# EAGLE design Tachometer-with-4x7-Segm-LED-Display_pcb (EAGLE 9.6.2)
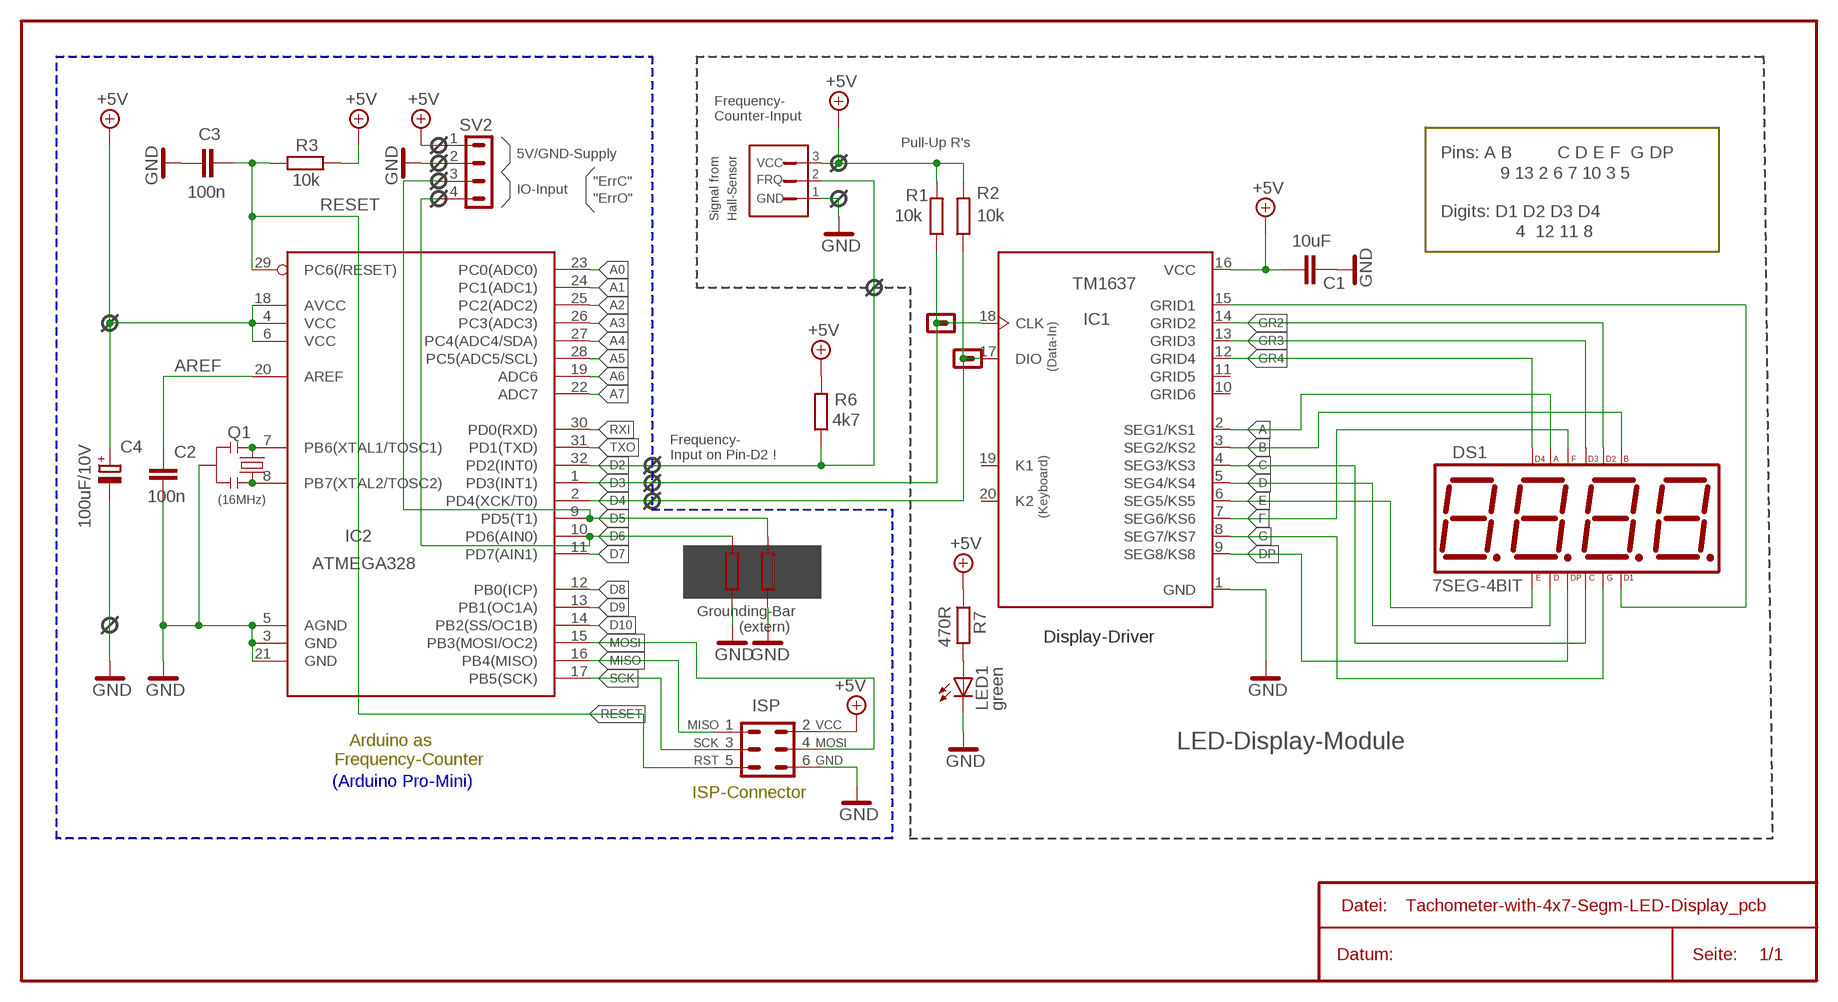
[diagram p0: schematic, sheet 1]

## Parts
C1  10uF  C-EUC0805  [C0805]
C2  100n  C-EUC0603  [C0603]
C3  100n  C-EUC0603  [C0603]
C4  100uF/10V  CPOL-EUE2.5-7  [E2,5-7]
DS1  7SEG-4BIT  7SEG-4BT  [7SEG-14-4BIT]
H  Hall-Ss.  3JST-XH  [3JST-XH]
IC1  TM1637  [SOP-20]
IC2  ATMEGA328  ATMEGA168  [TQFP32-08]
ISP  MA03-2  [MA03-2]
LED1  green  LEDCHIPLED_0603  [CHIPLED_0603]
Q1  (16MHz)  RESONATOR1:1  [RESONATOR-SMD-1:1]
R1  10k  R-EU_R0603  [R0603]
R2  10k  R-EU_R0603  [R0603]
R3  10k  R-EU_R0603  [R0603]
R4  10k  R-EU_R0603  [R0603]
R5  10k  R-EU_R0603  [R0603]
R6  4k7  R-EU_R0603  [R0603]
R7  470R  R-EU_R0603  [R0603]
SV2  MA04-10  [MA04-1]

## Nets
+5V: C1.1 C4.+ H.1 IC1.16(VCC) IC2.4(VCC) IC2.6(VCC) IC2.18(AVCC) ISP.2 R1.2 R2.2 R3.2 R6.2 R7.1 SV2.1
A: DS1.A IC1.2(SEG1/KS1)
A0: IC2.23(PC0(ADC0))
A1: IC2.24(PC1(ADC1))
A2: IC2.25(PC2(ADC2))
A3: IC2.26(PC3(ADC3))
A4: IC2.27(PC4(ADC4/SDA))
A5: IC2.28(PC5(ADC5/SCL))
A6: IC2.19(ADC6)
A7: IC2.22(ADC7)
AREF: C2.1 IC2.20(AREF)
B: DS1.B IC1.3(SEG2/KS2)
C: DS1.C IC1.4(SEG3/KS3)
D: DS1.D IC1.5(SEG4/KS4)
D2: H.2 IC2.32(PD2(INT0)) R6.1
D3: IC1.18(CLK) IC2.1(PD3(INT1)) R1.1
D4: IC1.17(DIO) IC2.2(PD4(XCK/T0)) R2.1
D5: IC2.9(PD5(T1)) R5.2 SV2.3
D6: IC2.10(PD6(AIN0)) R4.2 SV2.4
D7: IC2.11(PD7(AIN1))
D8: IC2.12(PB0(ICP))
D9: IC2.13(PB1(OC1A))
D10: IC2.14(PB2(SS/OC1B))
DP: DS1.DP IC1.9(SEG8/KS8)
E: DS1.E IC1.6(SEG5/KS5)
F: DS1.F IC1.7(SEG6/KS6)
G: DS1.G IC1.8(SEG7/KS7)
GND: C1.2 C2.2 C3.1 C4.- H.3 IC1.1(GND) IC2.3(GND) IC2.5(AGND) IC2.21(GND) ISP.6 LED1.C Q1.2 R4.1 R5.1 SV2.2
GR1: DS1.D1 IC1.15(GRID1)
GR2: DS1.D2 IC1.14(GRID2)
GR3: DS1.D3 IC1.13(GRID3)
GR4: DS1.D4 IC1.12(GRID4)
MISO: IC2.16(PB4(MISO)) ISP.1
MOSI: IC2.15(PB3(MOSI/OC2)) ISP.4
N$1: LED1.A R7.2
N$6: IC2.8(PB7(XTAL2/TOSC2)) Q1.3
N$7: IC2.7(PB6(XTAL1/TOSC1)) Q1.1
RESET: C3.2 IC2.29(PC6(/RESET)) ISP.5 R3.1
RXI: IC2.30(PD0(RXD))
SCK: IC2.17(PB5(SCK)) ISP.3
TXO: IC2.31(PD1(TXD))
Unconnected: IC1.10(GRID6) IC1.11(GRID5) IC1.19(K1) IC1.20(K2)

## Notes on the sheet
- Frequency-
  Counter-Input
- Pull-Up R's
- 5V/GND-Supply | 3 | Pins: A B | C D E F  G DP
- VCC
- 2 | 9 13 2 6 7 10 3 5
- FRQ
- IO-Input | 1
- "ErrC"
  "ErrO"
- GND
- Digits: D1 D2 D3 D4
- Signal from
  Hall-Sensor
- 4  12 11 8
- (Data-In)
- Frequency-
  Input on Pin-D2 !
- (Keyboard)
- Grounding-Bar
- (extern)
- Display-Driver
- LED-Display-Module
- Arduino as
  Frequency-Counter
- MISO
  SCK
  RST
- VCC
  MOSI
  GND
- (Arduino Pro-Mini)
- ISP-Connector

## Library data of the parts
C1-C3 = rcl1:C-EU: CAPACITOR, European symbol
C4 = rcl1:CPOL-EU: POLARIZED CAPACITOR, European symbol
DS1 = special:7SEG-4BT: 7-segment LED-Display - 4 bit LED-height: 14 mm Dimensions: 20 x 50 x 6 mm
H = con-jst:3JST-XH: JST-XH Connector: 2.5 mm pitch, disconnectable crimp-style connector • Current rating: 3 A AC/DC (AWG #22) • Voltage rating: 250 V AC/DC • Temperature range: -25°C to +85 • Contact resistance: 10-20 mΩ • Applicable wire: AWG #30 to #22 • Applicable PC board thickness: 1.6 mm • mounting height: 7mm (total height: 9.8mm)
IC1 = special:TM1637: LED Drive Control Special Circuit • Applied power CMOS technique • The display mode (8 segments*6 bit) supports output by common anode LED • Keyboard scan (8×2bit), with enhanced identification circuit with anti-interference keys • Luminance adjustment circuit (adjustable 8 duty ratio) • Two-wire serial interface (CLK, DIO) • Oscillating type: Built-in RC oscillator • Built-in power-on reset circuit • Built-in automatic blanking circuit • Package type: DIP20/SOP20
IC2 = SparkFun:ATMEGA168
ISP = con-lstc:MA03-2: PIN HEADER; OC_FARNELL: unknown; OC_NEWARK: unknown
LED1 = arduino_Uno_Rev3-02-TH:LED: LED OSRAM: - CHIPLED LG R971, LG N971, LY N971, LG Q971, LY Q971, LO R971, LY R971 LH N974, LH R974 LS Q976, LO Q976, LY Q976 LO Q996 - Hyper CHIPLED LW Q18S LB Q993, LB Q99A, LB R99A - SideLED LS A670, LO A670, LY A670, LG A670, LP A670 LB A673, LV A673, LT A673, LW A673 LH A674 LY A675 LS A676, LA A676, LO A676, LY A676, LW A676 LS A679, LY A679, LG A679 - Hyper Micro SIDELED® LS Y876, LA Y876, LO Y876, LY Y876 LT Y87S - SmartLED LW L88C, LW L88S LB L89C, LB L89S, LG L890 LS L89K, LO L89K, LY L89K LS L896, LA L896, LO L896, LY L896 - TOPLED LS T670, LO T670, LY T670, LG T670, LP T670 LSG T670, LSP T670, LSY T670, LOP T670, LYG T670 LG T671, LOG T671, LSG T671 LB T673, LV T673, LT T673, LW T673 LH T674 LS T676, LA T676, LO T676, LY T676, LB T676, LH T676, LSB T676, LW T676 LB T67C, LV T67C, LT T67C, LS T67K, LO T67K, LY T67K, LW E67C LS E67B, LA E67B, LO E67B, LY E67B, LB E67C, LV E67C, LT E67C LW T67C LS T679, LY T679, LG T679 LS T770, LO T770, LY T770, LG T770, LP T770 LB T773, LV T773, LT T773, LW T773 LH T774 LS E675, LA E675, LY E675, LS T675 LS T776, LA T776, LO T776, LY T776, LB T776 LHGB T686 LT T68C, LB T68C - Hyper Mini TOPLED® LB M676 - Mini TOPLED Santana® LG M470 LS M47K, LO M47K, LY M47K Source: http://www.osram.convergy.de LUXEON: - LUMILED® LXK2-PW12-R00, LXK2-PW12-S00, LXK2-PW14-U00, LXK2-PW14-V00 LXK2-PM12-R00, LXK2-PM12-S00, LXK2-PM14-U00 LXK2-PE12-Q00, LXK2-PE12-R00, LXK2-PE12-S00, LXK2-PE14-T00, LXK2-PE14-U00 LXK2-PB12-K00, LXK2-PB12-L00, LXK2-PB12-M00, LXK2-PB14-N00, LXK2-PB14-P00, LXK2-PB14-Q00 LXK2-PR12-L00, LXK2-PR12-M00, LXK2-PR14-Q00, LXK2-PR14-R00 LXK2-PD12-Q00, LXK2-PD12-R00, LXK2-PD12-S00 LXK2-PH12-R00, LXK2-PH12-S00 LXK2-PL12-P00, LXK2-PL12-Q00, LXK2-PL12-R00 Source: www.luxeon.com KINGBRIGHT: KA-3528ASYC Source: www.kingbright.com
Q1 = Testing:RESONATOR: Resonator Small SMD resonator. This is the itty bitty 10/20MHz resonators with built in caps. CSTCE10M0G55 and CSTCE20M0V53. Footprint for SMD has been used in SFE production for years, and does work okay. 1:1 is an attempt to get larger fillets on the sides so it will be easier to inspect these solders in our AOI machine. The pads have been minimized to match the actual metal under the resonator. To see this relation, it includes an image import of the bottom side of the component. Imported to scale on layer 200.
R1-R7 = rcl1:R-EU_: RESISTOR, European symbol
SV2 = con-lstc:MA04-1: PIN HEADER; OC_FARNELL: unknown; OC_NEWARK: unknown

## Net classes
1 vcc: width 0.254 mm

## Board
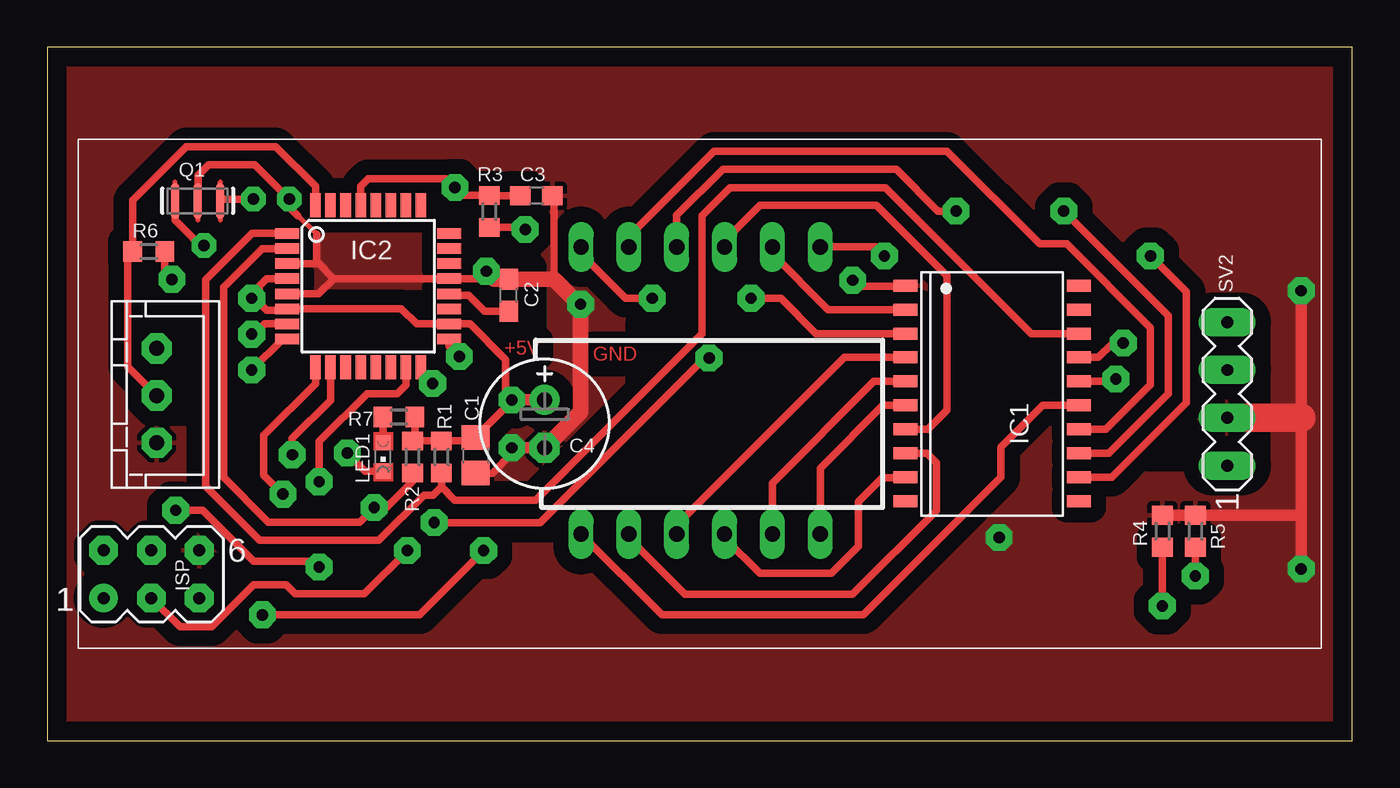
[diagram p1: board, top side]
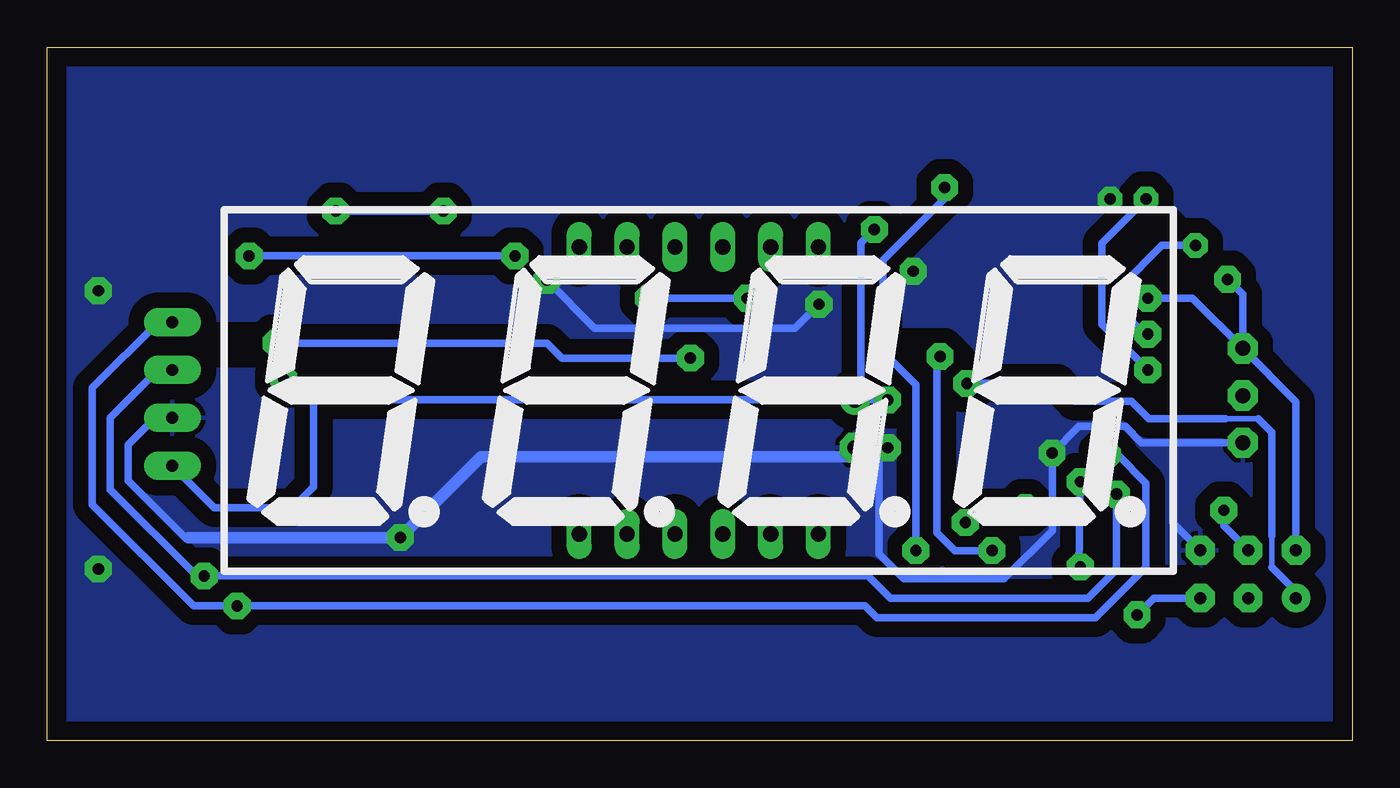
[diagram p2: board, bottom side, seen from below]

Size 69.3 x 36.8 mm. Coordinates in mm from the lower left corner, seen from the top.
Outline: 0,0 69.3,0 69.3,36.8 0,36.8 0,0
Copper layers (1*16): Top 0.035mm / dielectric 1.5mm / Bottom 0.035mm
Design rules "default": minimum track width 10mil, minimum drill 24mil, track to track 8mil, track to pad 8mil, pad to pad 8mil, via to via 8mil, smd to smd 8mil, copper to edge 40mil, drill to drill 8mil, minimum pad ring 10mil, minimum via ring 8mil, stop-mask expansion 4mil, vias tented up to drill 0mil, thermal gap 10mil
tRestrict: area 22.5,22.1 to 25.7,25.1; area 31.5,18.7 to 32.1,22.1; area 17.5,8.2 to 21.4,11.9; area 15.2,14.2 to 16.3,15.7; area 6,17.5 to 7.5,18.3; area 5,18.4 to 6.1,21.7; area 57.7,15.1 to 61.6,16; area 24.3,11.3 to 27.5,12.3; area 63.5,14.6 to 64.2,22.2; area 42.5,23.5 to 44.9,25.3; area 18.5,22.3 to 20.4,23.1; area 6.3,27.8 to 13.7,29.7
bRestrict: area 63.9,16 to 64.7,17.6; area 57.9,20.6 to 61.2,21.4; area 22.4,19.6 to 24,21.1; area 8.5,7.7 to 10.1,8.5; area 9.2,26.4 to 10.9,28.1; area 20.1,19 to 21.8,20.7; area 24.7,17.4 to 26.2,18.1

### Footprints (pad centres in the part's own frame; a part is rotated, then mirrored left to right if it is on the bottom)
C0805 = smd 1.3 x 1.5: 1 -0.95,0; 2 0.95,0
C0603 = smd 1.1 x 1: 1 -0.85,0; 2 0.85,0
E2,5-7 = drill 0.813 pad 1.6: + -1.27,0 | drill 0.813 pad 1.6 octagon: - 1.27,0
7SEG-14-4BIT = drill 0.813 long: A -2.54,7.62; B 7.62,7.62; C 2.54,-7.62; D -2.54,-7.62; D1 7.62,-7.62; D2 5.08,7.62; D3 2.54,7.62; D4 -5.08,7.62; DP 0,-7.62; E -5.08,-7.62; F 0,7.62; G 5.08,-7.62
3JST-XH = drill 0.8 pad 1.6 octagon: 1 0,0; 2 2.5,0; 3 5,0
SOP-20 = smd 0.635 x 1.27: 1 -5.75,-4.61; 2 -4.48,-4.61; 3 -3.21,-4.61; 4 -1.94,-4.61; 5 -0.67,-4.61; 6 0.6,-4.61; 7 1.87,-4.61; 8 3.14,-4.61; 9 4.41,-4.61; 10 5.68,-4.61; 11 5.68,4.61; 12 4.41,4.61; 13 3.14,4.61; 14 1.87,4.61; 15 0.6,4.61; 16 -0.67,4.61; 17 -1.94,4.61; 18 -3.21,4.61; 19 -4.48,4.61; 20 -5.75,4.61
TQFP32-08 = smd 1.27 x 0.559: 1 -4.293,2.8; 2 -4.293,2; 3 -4.293,1.2; 4 -4.293,0.4; 5 -4.293,-0.4; 6 -4.293,-1.2; 7 -4.293,-2; 8 -4.293,-2.8; 17 4.293,-2.8; 18 4.293,-2; 19 4.293,-1.2; 20 4.293,-0.4; 21 4.293,0.4; 22 4.293,1.2; 23 4.293,2; 24 4.293,2.8 | smd 0.559 x 1.27: 9 -2.8,-4.293; 10 -2,-4.293; 11 -1.2,-4.293; 12 -0.4,-4.293; 13 0.4,-4.293; 14 1.2,-4.293; 15 2,-4.293; 16 2.8,-4.293; 25 2.8,4.293; 26 2,4.293; 27 1.2,4.293; 28 0.4,4.293; 29 -0.4,4.293; 30 -1.2,4.293; 31 -2,4.293; 32 -2.8,4.293
MA03-2 = drill 0.635 pad 1.524: 1 -2.54,-1.27 | drill 0.635 pad 1.524 octagon: 2 -2.54,1.27; 3 0,-1.27; 4 0,1.27; 5 2.54,-1.27; 6 2.54,1.27
CHIPLED_0603 = smd 0.8 x 0.8: A 0,-0.75; C 0,0.75
RESONATOR-SMD-1:1 = smd 0.45 x 1.905: 1 -1.2,0; 2 0,0; 3 1.2,0
R0603 = smd 1 x 1.1: 1 -0.85,0; 2 0.85,0
MA04-1 = drill 0.635 pad 1.524 long: 1 -3.81,0; 2 -1.27,0; 3 1.27,0; 4 3.81,0

### Placement (x,y rotation side)
C1  22.75,15.14 270 top
C2  24.51,23.63 90 top
C3  25.98,28.92 180 top
C4  26.41,16.81 270 top
DS1  35.97,18.58 0 bottom
H  5.83,20.81 270 top
IC1  50.17,18.39 270 top
IC2  17.05,24.11 0 top
ISP  5.54,8.83 0 top
LED1  17.84,15.05 180 top
Q1  8,28.64 0 top
R1  20.93,15.05 90 top
R2  19.4,15.05 90 top
R3  23.48,28.08 270 top
R4  59.21,11.11 270 top
R5  60.96,11.11 270 top
R6  5.4,25.95 0 top
R7  18.68,17.16 180 top
SV2  62.65,18.39 90 top

### Tracks (layer width: path | path; a pad name or v marks a point on that pad's centre or on a via)
+5V  (via drill 0.6 pad 1.42)
  Top 0.406: IC1.16 56.55,19.06 56.68,19.19 v56.74,19.19 | C1.1 22.41,15.91 | IC2.6 | IC2.4 11.65,24.51 11.25,24.11 11.25,23.47 | IC2.6 12.69,22.84 11.65,22.84 11.25,23.24 11.25,23.47 | C1.1 24.5,17.84 24.67,18 v24.67,18.08 24.35,18.39 24.35,20.22 22.46,22.11 IC2.18 19.6,22.11 18.8,22.91 IC2.6 | 19.37,16.02 R2.2 19.53,15.9 | v10.86,23.47 11.25,23.47 | 19.53,15.9 R1.2 22.4,15.9 C1.1 | R7.1 19.53,15.9 | R3.2 25.28,27.23 v25.38,27.12 | R6.2 6.25,24.85 v6.63,24.47
  Top 0.61: v24.67,18.08 C4.+
  Bottom 0.406: 55.15,18.08 26.1,18.08 | v25.38,27.12 26.1,26.41 26.1,18.08 | SV2.1 60.43,12.36 56.26,12.36 55.15,13.47 55.15,18.08 | 55.15,18.08 56.26,19.19 v56.74,19.19 | H.1 8.49,23.47 v10.86,23.47 | H.1 3,17.98 ISP.2 | 26.1,18.08 v24.67,18.08 | v6.63,24.47 5.83,23.67 H.1
A
  Top 0.406: IC1.2 41.47,22.87 38.51,25.83 DS1.A
AREF
  Top 0.406: IC2.20 21.42,23.63 22.37,23.63 23.22,22.78 C2.1
B  (via drill 0.6 pad 1.42)
  Top 0.406: IC1.3 40.83,21.6 38.96,23.47 v37.37,23.47 | DS1.B 28.35,25.83 30.7,23.47 v32.13,23.47
  Bottom 0.406: v37.37,23.47 v32.13,23.47
C
  Top 0.406: IC1.4 42.32,20.33 33.43,11.44 DS1.C
D
  Top 0.406: DS1.D 38.51,13.66 43.91,19.06 IC1.5
D2
  Top 0.406: 14.25,28.42 14.26,28.41 IC2.32 14.25,29.41 12.14,31.51 7.38,31.51 4.55,28.68 R6.1 4.29,25.68 4.29,19.85 H.2
D3
  Top 0.406: 12.7,26.97 IC2.1 10.88,26.91 8.41,24.45 8.41,13.49 11.29,10.62 17.6,10.62 20,13.02 20.48,13.02 20.93,13.47 | 20.93,13.47 R1.1 | 20.93,13.47 21.64,12.76 25.93,12.76 34.77,21.59 34.77,27.85 36.26,29.35 44.51,29.35 52.26,21.6 IC1.18
D4  (via drill 0.6 pad 1.42)
  Top 0.406: IC1.17 55.81,20.33 56.58,21.09 v57.13,21.09 | IC2.2 11.43,26.11 9.37,24.05 9.37,13.97 11.75,11.59 16.59,11.59 v17.37,12.36 18,12.36 19.4,13.76 R2.1 | v20.54,11.57 26.18,11.57 34.91,20.3 v35.15,20.3
  Bottom 0.406: v35.15,20.3 41.97,20.3 42.77,21.09 v57.13,21.09 | v20.54,11.57 19.75,12.36 v17.37,12.36
D5  (via drill 0.6 pad 1.42)
  Top 0.406: IC2.9 14.25,18.93 11.51,16.19 11.51,14.09 v12.52,13.08 | R5.2 v60.96,8.73
  Bottom 0.406: SV2.3 63.4,19.66 65.94,17.12 65.94,13.31 61.36,8.73 v60.96,8.73 25.72,8.73 24.53,7.54 14.05,7.54 12.52,9.07 v12.52,13.08
D6  (via drill 0.6 pad 1.42)
  Top 0.406: IC2.10 15.05,18.07 13.02,16.03 v13.02,15.16 | R4.2 v59.21,7.14
  Bottom 0.406: SV2.4 63.4,22.2 66.9,18.71 66.9,12.52 61.52,7.14 v59.21,7.14 25.88,7.14 25.25,6.51 13.65,6.51 10.95,9.21 10.95,13.65 12.46,15.16 v13.02,15.16
DP
  Top 0.406: IC1.9 45.53,13.95 44.35,13.95 43.08,12.68 43.08,10.3 41.66,8.87 37.84,8.87 35.97,10.75 DS1.DP
E
  Top 0.406: DS1.E 41.05,14.45 44.38,17.79 IC1.6
F
  Top 0.406: IC1.7 46.76,16.52 47.77,17.52 47.77,24.66 44.04,28.39 37.85,28.39 35.97,26.51 DS1.F
G
  Top 0.406: IC1.8 46.71,15.25 47.21,14.74 47.21,12.2 42.77,7.76 33.88,7.76 30.89,10.75 DS1.G
GND  (via drill 0.6 pad 1.42, 0.61 pad 1.3)
  Top 0.254: 14.3,26.87 13.31,27.86 13.29,27.86
  Top 0.406: IC1.1 45.53,24.11 43.08,24.11 v42.77,24.43 | 22.6,13.79 C1.2 23.64,14.19 24.67,15.22 v24.67,15.54 | IC2.5 14.43,23.71 15.23,24.51 | IC2.3 14.38,25.31 14.38,25.35 | 15.23,24.51 15.22,24.51 14.38,25.35 | 15.23,24.51 IC2.21 22.85,24.51 v23.32,24.9 | LED1.C 16.88,14.3 v15.94,15.26 | C3.1 26.99,28.54 26.91,28.47 26.91,24.48 | R5.1 61.59,11.96 61.59,12.06 | Q1.2 8.02,28.66 8.02,30 8.57,30.56 11.03,30.56 v12.86,28.73 12.86,28.3 13.29,27.86 | 14.3,26.87 14.3,25.43 14.38,25.35
  Top 0.61: v24.67,15.54 C4.- | v66.58,23.87 66.58,17.12 66.58,11.96 | 66.58,11.96 v66.58,9.11 | R4.1 R5.1 66.58,11.96
  Top 0.813: 28.32,23.08 28.32,17.42 26.43,15.54 C4.- | 28.32,23.08 v28.32,23.16 | v23.32,24.9 23.74,24.48 C2.2 26.91,24.48 28.32,23.08
  Top 1.524: 66.58,17.12 SV2.2
  Bottom 0.406: v42.77,24.43 40.23,21.89 29.59,21.89 v28.32,23.16 28.28,23.16 | SV2.2 63.56,17.12 64.99,15.7 64.99,13.79 61.98,10.77 61.82,10.77 | 25.14,15.06 25.14,9.9 23.81,8.57 18.49,8.57 15.94,11.13 v15.94,15.26 14.53,16.67 12.06,16.67 11.2,15.81 9.53,15.81 | 9.53,15.81 H.3 | ISP.6 9.53,11.55 9.53,15.81
  Bottom 0.61: 26.41,15.06 25.14,15.06 v24.67,15.54 | 26.41,15.06 46.26,15.06 v50.55,10.77 61.82,10.77 | C4.- 26.41,15.06
  pour Top (isolate 0.813): -0.32,-0.32 69.66,-0.32 69.66,37.1 -0.32,37.1
  pour Bottom (isolate 0.813): -0.32,-0.32 69.66,-0.32 69.66,37.1 -0.32,37.1
GR1
  Top 0.406: DS1.D1 32.64,6.67 43.34,6.67 50.64,13.97 50.64,15.56 52.87,17.79 IC1.15
GR2
  Top 0.406: IC1.14 56.21,16.52 58.58,18.89 58.58,21.91 54.13,26.35 52.7,26.35 47.78,31.27 35.4,31.27 30.89,26.76 DS1.D2
GR3  (via drill 0.6 pad 1.42)
  Top 0.406: DS1.D3 33.43,27.87 35.88,30.32 45.09,30.32 47.31,28.1 v48.26,28.1 | IC1.13 56.36,15.25 59.53,18.41 59.53,22.54 v53.98,28.1
  Bottom 0.406: v48.26,28.1 v53.98,28.1
GR4  (via drill 0.6 pad 1.42)
  Top 0.406: IC1.12 56.52,13.98 60.48,17.94 60.48,23.81 v58.58,25.72 | DS1.D4 43.97,26.2 v44.45,25.72
  Bottom 0.406: v44.45,25.72 v58.58,25.72
MISO  (via drill 0.6 pad 1.42)
  Top 0.406: IC2.16 19.85,19.56 v20.46,18.95
  Bottom 0.305: 6.75,17.07 5,17.07 | 4.29,10.87 4.29,9.21
  Bottom 0.406: v20.46,18.95 15.66,18.95 14.73,18.02 11.75,18.02 10.79,17.07 6.75,17.07 | 5,17.07 4.29,16.35 4.29,10.87 | 4.29,9.21 3,7.92 ISP.1
MOSI  (via drill 0.6 pad 1.42)
  Top 0.406: IC2.15 19.05,18.89 18.57,18.41 16.99,18.41 14.45,15.88 v14.45,13.73 | v6.83,12.22 8.26,12.22 10.95,9.53 14.05,9.53 v14.45,9.21
  Bottom 0.406: ISP.4 6.83,11.39 v6.83,12.22 | v14.45,13.73 14.53,9.29 v14.45,9.21
N$1
  Top 0.406: R7.2 17.84,17.1 17.84,15.96 LED1.A
N$6  (via drill 0.6 pad 1.42, 0.61 pad 1.3)
  Top 0.406: v10.95,28.73 9.29,28.73 Q1.3 | v10.86,19.66 12.5,21.31 IC2.8
  Bottom 0.406: v10.95,28.73 13.29,26.39 13.29,22.1 v10.86,19.66
N$7  (via drill 0.6 pad 1.42, 0.61 pad 1.3)
  Top 0.406: IC2.7 11.56,22.11 11.02,21.57 v10.86,21.57 | Q1.1 6.8,27.61 8.14,26.27 v8.33,26.27
  Bottom 0.406: v8.33,26.27 10.12,26.27 12.3,24.09 12.3,22.86 11.01,21.57 v10.86,21.57
RESET  (via drill 0.6 pad 1.42)
  Top 0.406: IC2.29 16.65,29.42 17.05,29.82 21.18,29.82 v21.65,29.35 22.07,28.93 R3.1 23.69,28.91 C3.2 | v11.43,6.67 19.76,6.67 v23.18,10.08
  Bottom 0.406: v21.65,29.35 21.65,28.75 24.92,25.48 24.92,20.64 23.18,18.89 v23.18,10.08 | ISP.5 10.54,7.56 v11.43,6.67
SCK  (via drill 0.6 pad 1.42)
  Top 0.406: IC2.17 21.34,20.93 v21.89,20.38 | v19.13,10.08 16.83,7.78 13.18,7.78 12.7,8.26 10.95,8.26 8.73,6.03 7.06,6.03 ISP.3
  Bottom 0.406: v19.13,10.08 21.11,10.08 22.05,11.02 22.05,20.22 v21.89,20.38
(copper drawn outside any net)
  shapes: Top area x2

### Text on the board
Top: +5V | GND
tValues: +5V / Freq / GND | D6 | D6 / D5 / GND / +5V | D5 | +5V | GND
tDocu: 7-Segment-LEDs on rear-side!
Text: Signal | Supply